# Altium schematic sheet tvac_systems_interface.SchDoc
size 195 x 146 mm
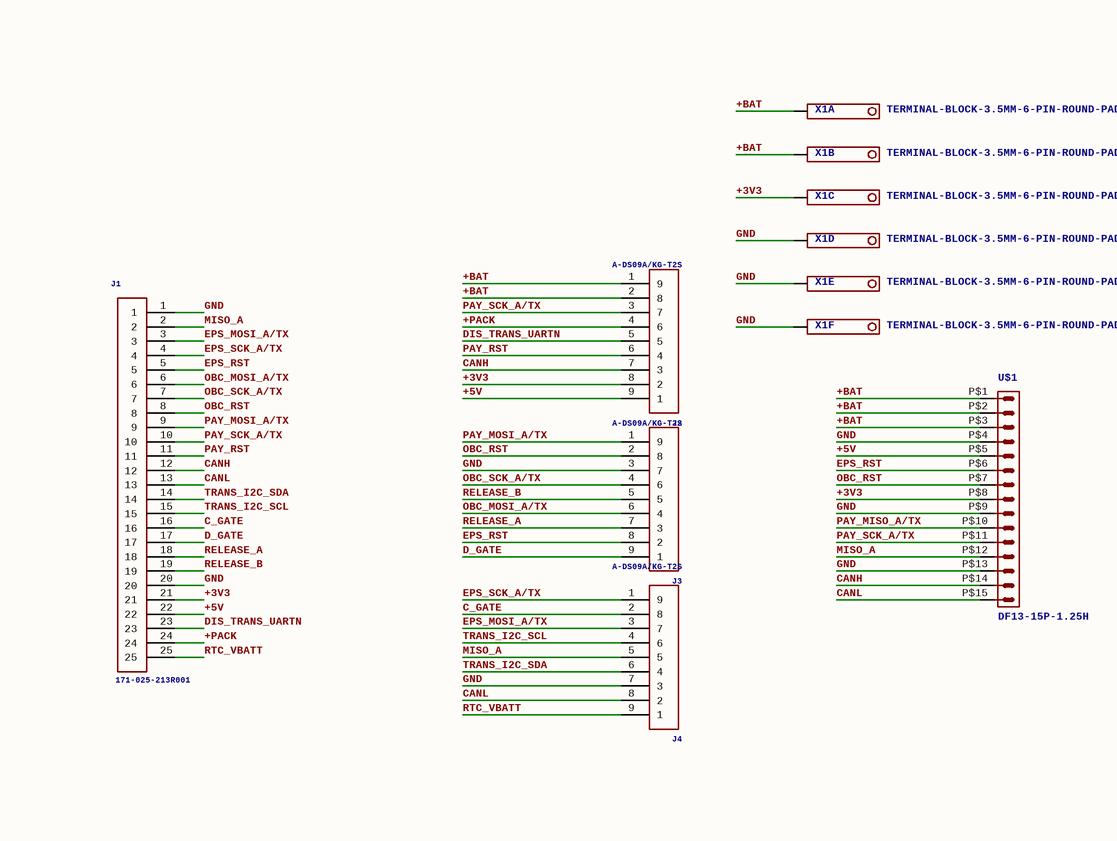
[diagram p0: tvac_systems_interface.SchDoc]

## Parts
J1  171-025-213R001  [171-025-213R001]
J2  A-DS09A/KG-T2S  [A-DS09A/KG-T2S]
J3  A-DS09A/KG-T2S  [A-DS09A/KG-T2S]
J4  A-DS09A/KG-T2S  [A-DS09A/KG-T2S]
U$1  DF13-15P-1.25H  [DF13A-15P-1.25H]
X1  TERMINAL-BLOCK-3.5MM-6-PIN-ROUND-PAD  [TERMINAL-BLOCK-6-PIN-3.5MM-ROUND-PAD]  (parts A,B,C,D,E,F of 6)

## Nets
+3V3: J1.21 J2.8(2) U$1.P$8 X1.3(K)
+5V: J1.22 J2.9(1) U$1.P$5
+BAT: J2.1(9) J2.2(8) U$1.P$1 U$1.P$2 U$1.P$3 X1.1(K) X1.2(K)
+PACK: J1.24 J2.4(6)
C_GATE: J1.16 J4.2(8)
CANH: J1.12 J2.7(3) U$1.P$14
CANL: J1.13 J4.8(2) U$1.P$15
D_GATE: J1.17 J3.9(1)
DIS_TRANS_UARTN: J1.23 J2.5
EPS_MOSI_A/TX: J1.3 J4.3(7)
EPS_RST: J1.5 J3.8(2) U$1.P$6
EPS_SCK_A/TX: J1.4 J4.1(9)
GND: J1.1 J1.20 J3.3(7) J4.7(3) U$1.P$4 U$1.P$9 U$1.P$13 X1.4(K) X1.5(K) X1.6(K)
MISO_A: J1.2 J4.5 U$1.P$12
OBC_MOSI_A/TX: J1.6 J3.6(4)
OBC_RST: J1.8 J3.2(8) U$1.P$7
OBC_SCK_A/TX: J1.7 J3.4(6)
PAY_MISO_A/TX: U$1.P$10
PAY_MOSI_A/TX: J1.9 J3.1(9)
PAY_RST: J1.11 J2.6(4)
PAY_SCK_A/TX: J1.10 J2.3(7) U$1.P$11
RELEASE_A: J1.18 J3.7(3)
RELEASE_B: J1.19 J3.5
RTC_VBATT: J1.25 J4.9(1)
TRANS_I2C_SCL: J1.15 J4.4(6)
TRANS_I2C_SDA: J1.14 J4.6(4)

## Library data of the parts
J1 = 171-025-213R001: CONN D-SUB RCPT 25P PNL MNT SLDR    Manufacturer's datasheet; MANUFACTURER: NorComp Inc.; GateName_1: G$1; CREATED_BY: PCBLayout.com; SymbolName_1: 171-025-213R001; LibraryName: D-Sub Connectors; DeviceSetName: 171-025-213R001; DIGIKEY_PART_NO: 4225FE-ND; MPN: 171-025-213R001
J2-J4 = A-DS09A/KG-T2S: CONN D-SUB PLUG 9POS R/A SOLDER    Manufacturer's datasheet; DIGI_KEY_PART_NUMBER: AE10968-ND; MANUFACTURER: Assmann WSW Components; GateName_1: G$1; SymbolName_1: A-DS09A/KG-T2S; LibraryName: D-Sub Connectors; DeviceSetName: A-DS09A/KG-T2S; CREATEDBY: PCBLayout.com; MPN: A-DS 09 A/KG-T2S
U$1 = DF13-15P-1.25H: DF13-15P 1.25mm Pitch Miniature Crimping Connector.; GateName_1: G$1; SymbolName_1: CON-1X15P; DeviceName: H; LibraryName: con-hirose-df13; DeviceSetName: DF13-15P-1.25
X1 = TERMINAL-BLOCK-3.5MM-6-PIN-ROUND-PAD: Terminal Block 3.5mm   Pitch: 3,5 mm Number of pins: 6   Created by Rembrandt Electronics   www.rembrandtelectronics.com; GateName_1: -1; SymbolName_1: TERMINAL-BLOCK-PIN-3.5MM; GateName_2: -2; GateName_3: -3; GateName_4: -4; GateName_5: -5; GateName_6: -6; SymbolName_2: TERMINAL-BLOCK-PIN-3.5MM; SymbolName_3: TERMINAL-BLOCK-PIN-3.5MM; SymbolName_4: TERMINAL-BLOCK-PIN-3.5MM; SymbolName_5: TERMINAL-BLOCK-PIN-3.5MM; SymbolName_6: TERMINAL-BLOCK-PIN-3.5MM; DeviceName: -ROUND-PAD; LibraryName: Rembrandt Electronics - Terminal Block 3-5mm v1-0; DeviceSetName: TERMINAL-BLOCK-3.5MM-6-PIN